# EAGLE design Assignment1-5VAC-DCReg (EAGLE 9.6.2)
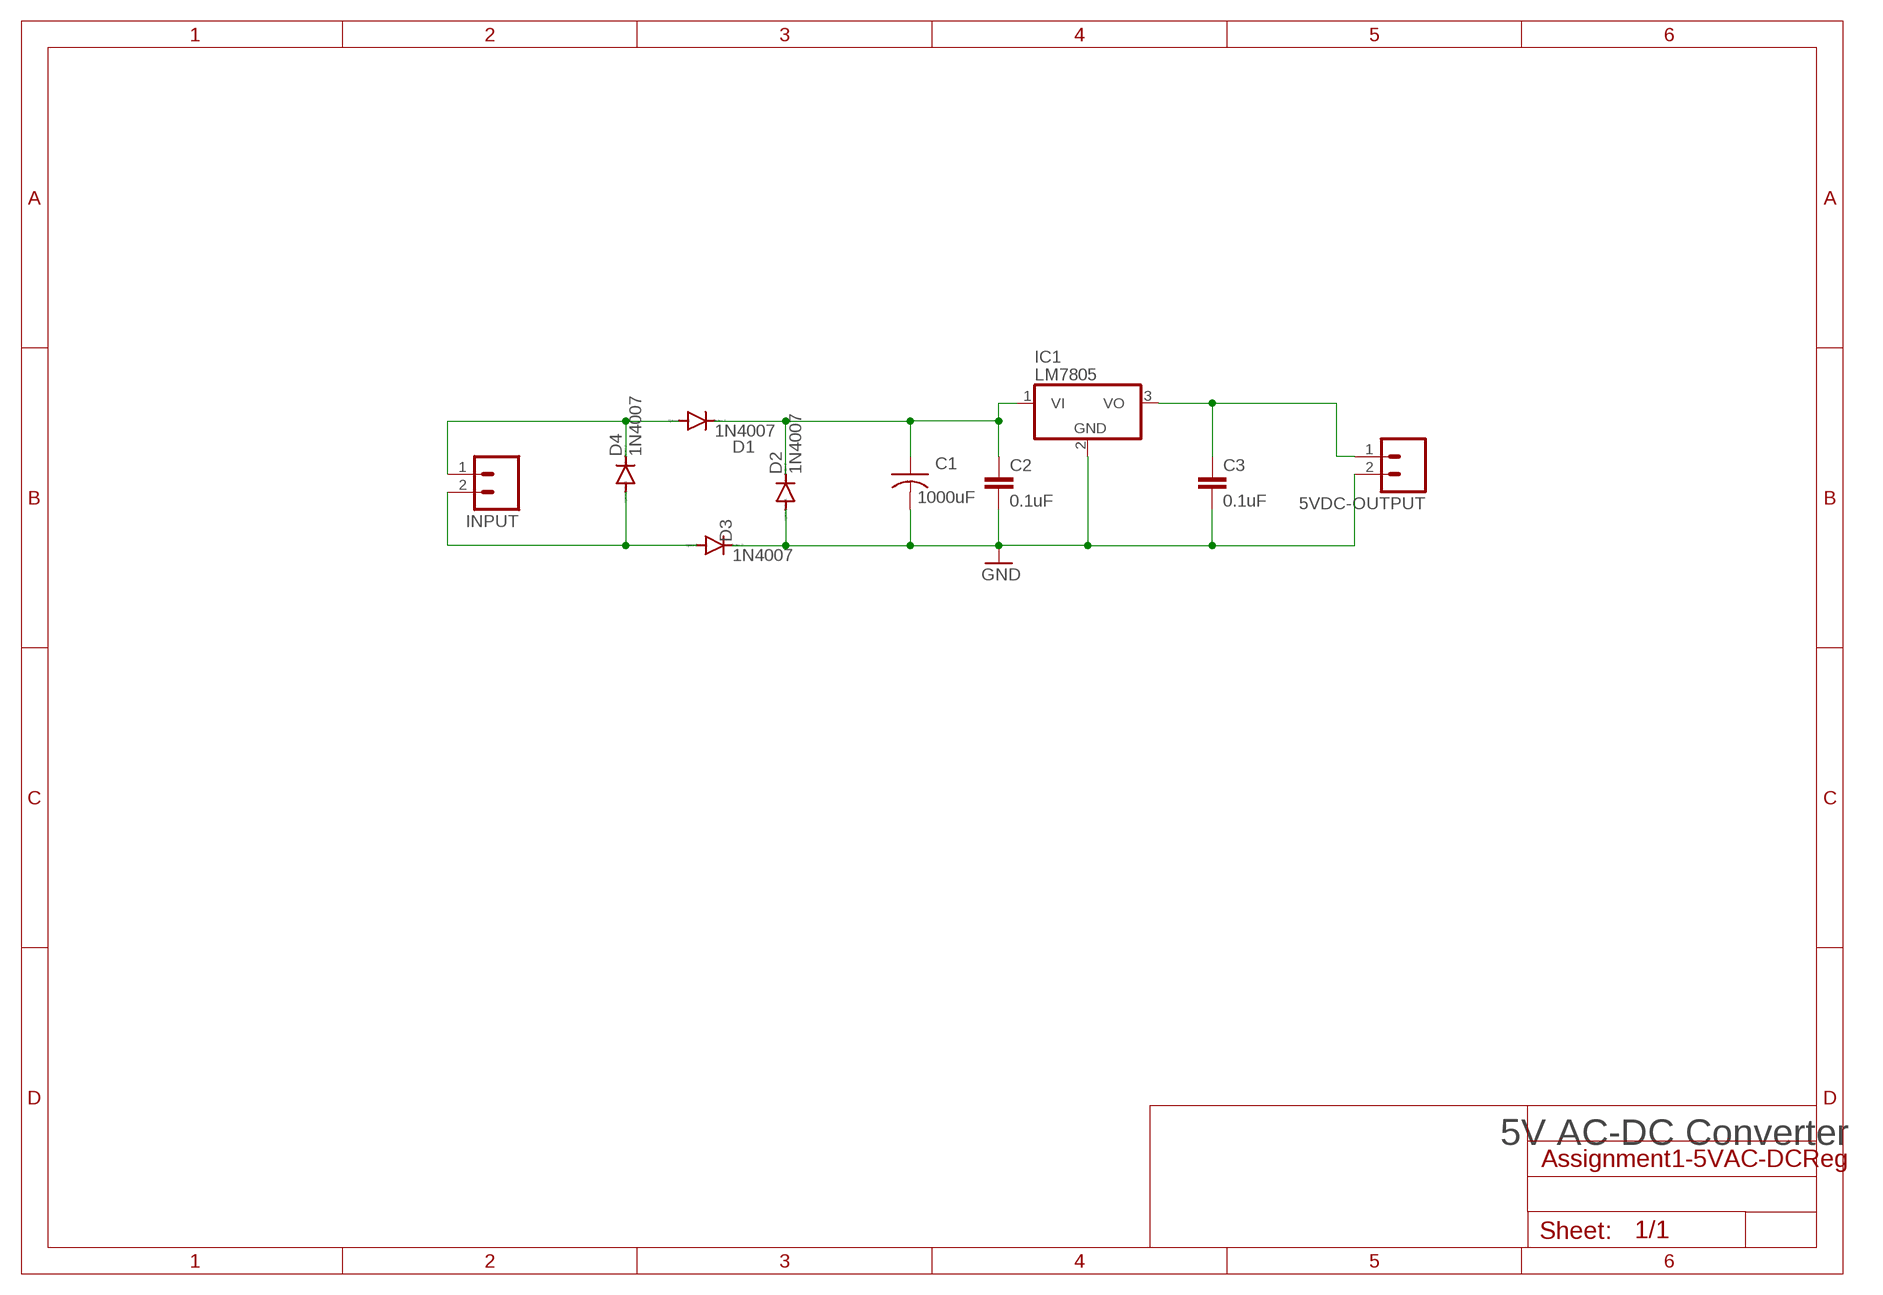
[diagram p0: schematic, sheet 1]

## Parts
5VDC-OUTPUT  M02  [02P]
C1  1000uF  C-US025-024X044  [C025-024X044]
C2  0.1uF  C-EU025-025X050  [C025-025X050]
C3  0.1uF  C-EU025-025X050  [C025-025X050]
D1  1N4007  1N4004  [DO41-10]
D2  1N4007  1N4004  [DO41-10]
D3  1N4007  1N4004  [DO41-10]
D4  1N4007  1N4004  [DO41-10]
IC1  LM7805  786TV  [TO220V]
INPUT  M02  [02P]

## Nets
GND: 5VDC-OUTPUT.2 C1.2 C2.2 C3.2 D2.A D3.C IC1.2(GND)
N$1: D1.A D4.C INPUT.1
N$2: D3.A D4.A INPUT.2
N$3: C1.1 C2.1 D1.C D2.C IC1.1(VI)
N$9: 5VDC-OUTPUT.1 C3.1 IC1.3(VO)

## Notes on the sheet
- 5V AC-DC Converter

## Library data of the parts
5VDC-OUTPUT INPUT = con-amp-quick:M02: AMP QUICK CONNECTOR; OC_FARNELL: unknown; OC_NEWARK: unknown
C1 = rcl:C-US: CAPACITOR, American symbol; SPICEPREFIX: C
C2 C3 = rcl:C-EU: CAPACITOR, European symbol; SPICEPREFIX: C
D1-D4 = diode:1N4004: DIODE general purpose rectifier, 1 A
IC1 = linear:78*: Positive VOLTAGE REGULATOR Source: http://cache.national.com/ds/LM/LM78L05.pdf http://www.fairchildsemi.com/ds/LM/LM7805.pdf

## Board
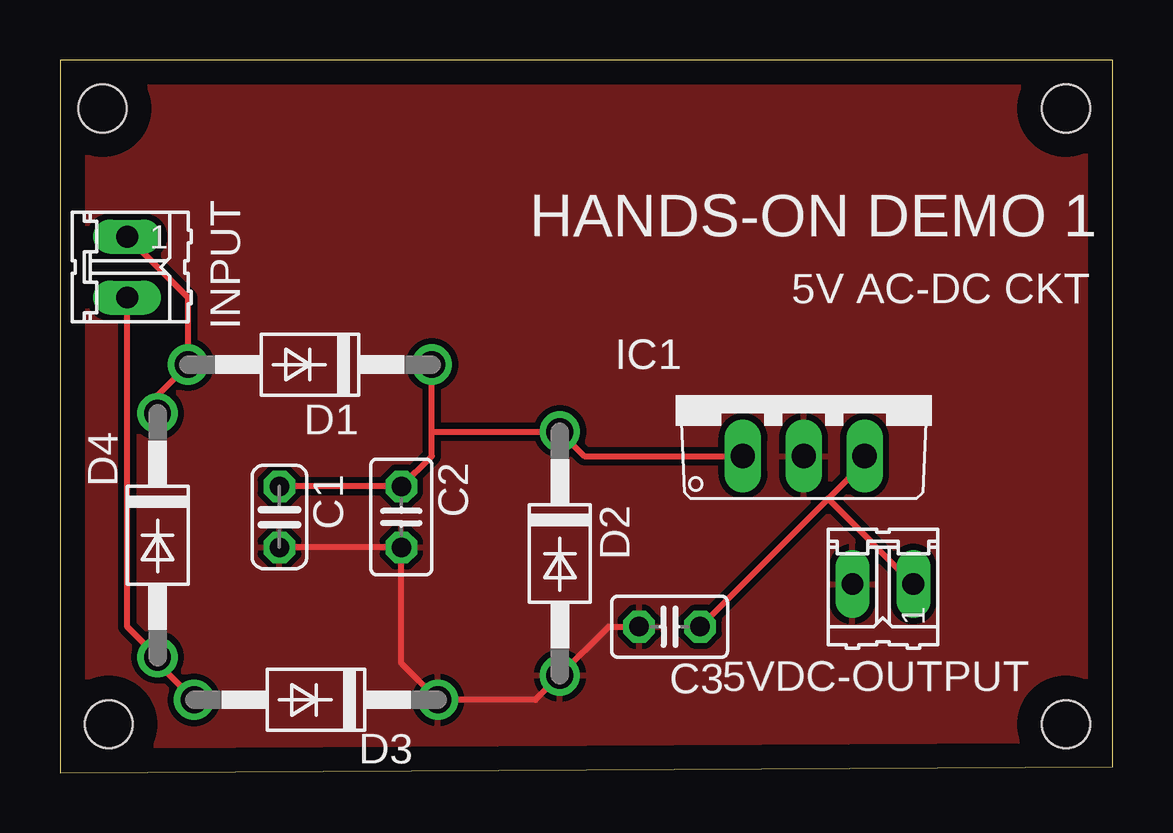
[diagram p1: board, top side]
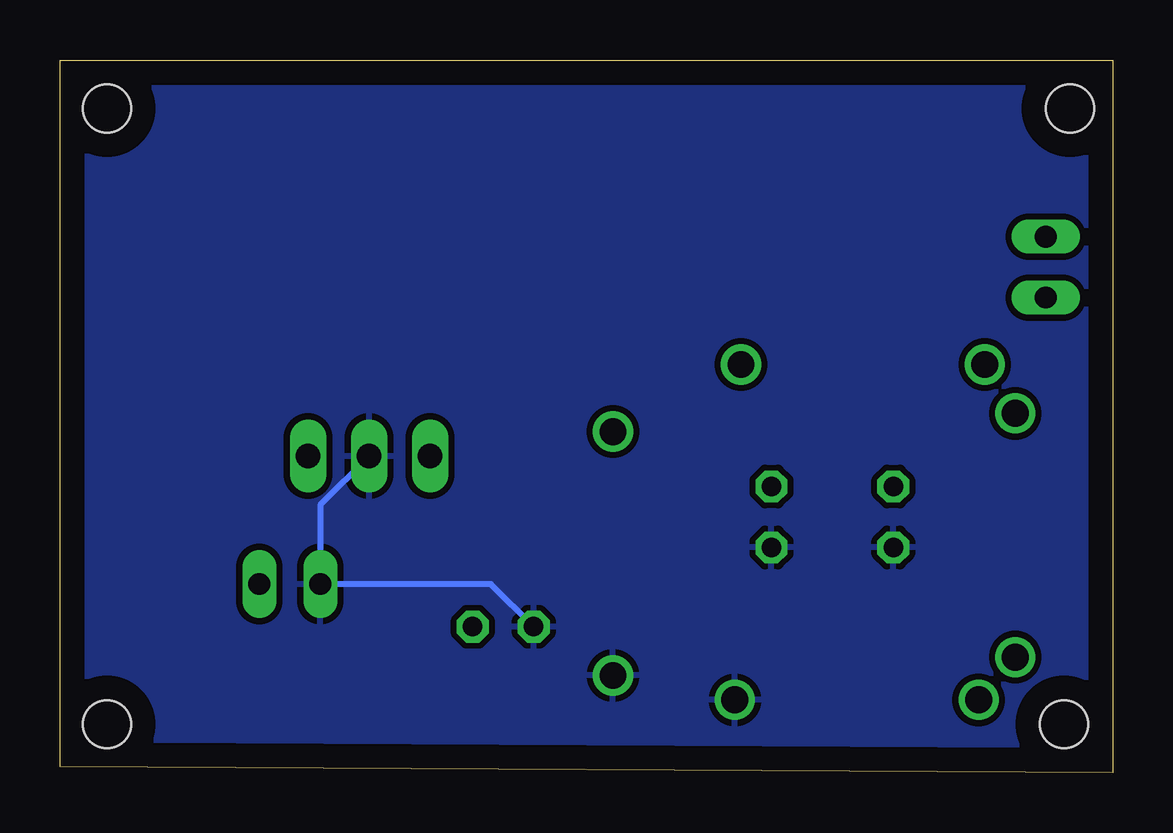
[diagram p2: board, bottom side, seen from below]

Size 43.87 x 29.71 mm. Coordinates in mm from the lower left corner, seen from the top.
Outline: 0,0 43.87,0.25 43.87,29.71 0,29.71 0,0
Copper layers (1*16): Top 0.035mm / dielectric 1.5mm / Bottom 0.035mm
Design rules "default *": minimum track width 10mil, minimum drill 0.35mm, track to track 10mil, track to pad 10mil, pad to pad 10mil, via to via 10mil, smd to smd 10mil, copper to edge 40mil, drill to drill 10mil, minimum pad ring 10mil, minimum via ring 8mil, stop-mask expansion 4mil, vias tented up to drill 0mil, thermal gap 10mil
Holes 2 mm at 1.78,27.69 41.91,27.69 2.03,2.03 41.91,2.03

### Footprints (pad centres in the part's own frame; a part is rotated, then mirrored left to right if it is on the bottom)
02P = drill 0.914 long: 1 -1.27,0; 2 1.27,0
C025-024X044 = drill 0.813 octagon: 1 -1.27,0; 2 1.27,0
C025-025X050 = drill 0.813 octagon: 1 -1.27,0; 2 1.27,0
DO41-10 = drill 1.118: A 5.08,0; C -5.08,0
TO220V = drill 1.016 long: 1 -2.54,-2.54; 2 0,-2.54; 3 2.54,-2.54

### Placement (x,y rotation side)
5VDC-OUTPUT  34.29,7.87 180 top
C1  9.14,10.67 270 top
C2  14.22,10.67 270 top
C3  25.4,6.1 180 top
D1  10.41,17.02 180 top
D2  20.83,9.14 270 top
D3  10.67,3.05 180 top
D4  4.06,9.91 270 top
IC1  30.99,15.75 0 top
INPUT  2.79,21.08 270 top

### Tracks (layer width: path | path; a pad name or v marks a point on that pad's centre or on a via)
GND
  Top 0.254: C1.2 C2.2 14.22,4.57 D3.C 19.81,3.05 D2.A 22.86,6.1 C3.2
  Bottom 0.254: IC1.2 33.02,11.18 5VDC-OUTPUT.2 25.91,7.87 C3.2
  pour Top: 44.25,30.2 44.25,0.13 -0.38,0.13 -0.38,30.2
  pour Bottom: -0.76,30.99 45.47,30.99 45.47,-1.27 -1.27,-1.27 -1.27,30.99
N$1
  Top 0.254: INPUT.1 5.33,19.81 D1.A 4.06,15.75 D4.C
N$2
  Top 0.254: INPUT.2 2.79,6.1 D4.A 4.06,4.57 D3.A
N$3
  Top 0.254: IC1.1 21.84,13.21 D2.C 15.49,14.22 | C1.1 C2.1 15.49,13.21 15.49,14.22 | 15.49,14.22 D1.C
N$9
  Top 0.254: 32,11.43 33.53,12.95 IC1.3 | 32,11.43 C3.1 | 32,11.43 5VDC-OUTPUT.1

### Text on the board
tNames: HANDS-ON DEMO 1 | 5V AC-DC CKT